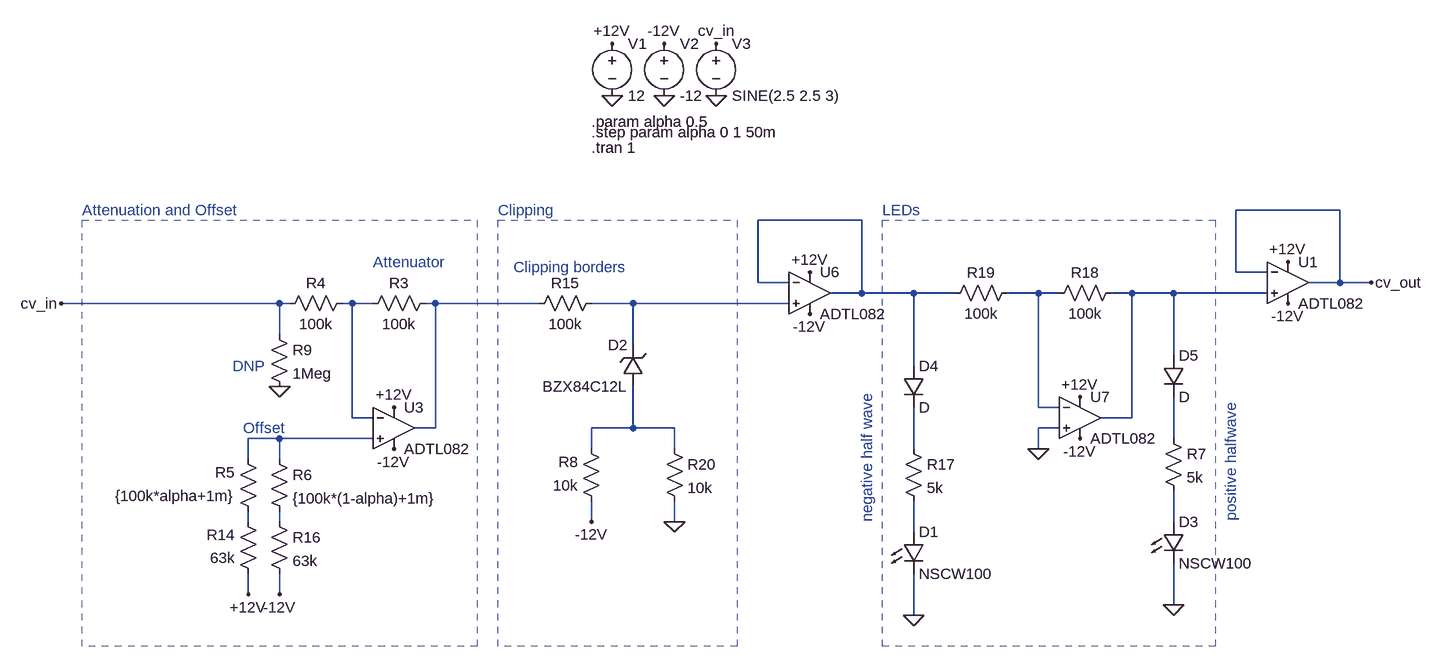
[diagram p0: schematic strg+m.asc]
strg+m.asc, the LTspice schematic file:
Version 4
SHEET 1 2040 1588
WIRE 1696 -16 1536 -16
WIRE 960 0 800 0
WIRE 1536 80 1536 -16
WIRE 1584 80 1536 80
WIRE 800 96 800 0
WIRE 848 96 800 96
WIRE 1696 96 1696 -16
WIRE 1696 96 1648 96
WIRE 1744 96 1696 96
WIRE 960 112 960 0
WIRE 960 112 912 112
WIRE 1040 112 960 112
WIRE 1104 112 1040 112
WIRE 1232 112 1184 112
WIRE 1264 112 1232 112
WIRE 1376 112 1344 112
WIRE 1440 112 1376 112
WIRE 1584 112 1440 112
WIRE 64 128 -272 128
WIRE 80 128 64 128
WIRE 176 128 160 128
WIRE 208 128 176 128
WIRE 304 128 288 128
WIRE 464 128 304 128
WIRE 608 128 544 128
WIRE 848 128 608 128
WIRE 64 176 64 128
WIRE 608 192 608 128
WIRE 1440 208 1440 112
WIRE 1040 224 1040 112
WIRE 1232 288 1232 112
WIRE 1264 288 1232 288
WIRE 176 304 176 128
WIRE 208 304 176 304
WIRE 1376 304 1376 112
WIRE 1376 304 1328 304
WIRE 304 320 304 128
WIRE 304 320 272 320
WIRE 608 320 608 256
WIRE 608 320 544 320
WIRE 672 320 608 320
WIRE 1264 320 1232 320
WIRE 64 336 16 336
WIRE 208 336 64 336
WIRE 1440 336 1440 272
WIRE 544 352 544 320
WIRE 672 352 672 320
WIRE 1040 352 1040 288
WIRE 1232 352 1232 320
WIRE 16 368 16 336
WIRE 64 368 64 336
WIRE 16 464 16 448
WIRE 64 464 64 448
WIRE 544 464 544 432
WIRE 672 464 672 432
WIRE 1440 464 1440 416
WIRE 1040 480 1040 432
WIRE 16 576 16 544
WIRE 64 576 64 544
WIRE 1440 592 1440 528
WIRE 1040 608 1040 544
FLAG 576 -192 0
FLAG 656 -192 0
FLAG 736 -192 0
FLAG 576 -272 +12V
FLAG 656 -272 -12V
FLAG 736 -272 cv_in
FLAG 240 288 +12V
FLAG 240 352 -12V
FLAG -272 128 cv_in
FLAG 16 576 +12V
FLAG 64 576 -12V
FLAG 64 256 0
FLAG 880 80 +12V
FLAG 880 144 -12V
FLAG 1744 96 cv_out
FLAG 1040 608 0
FLAG 1296 272 +12V
FLAG 1296 336 -12V
FLAG 1232 352 0
FLAG 1440 592 0
FLAG 672 464 0
FLAG 544 464 -12V
FLAG 1616 64 +12V
FLAG 1616 128 -12V
SYMBOL voltage 576 -288 R0
WINDOW 123 0 0 Left 0
WINDOW 39 0 0 Left 0
SYMATTR InstName V1
SYMATTR Value 12
SYMBOL voltage 656 -288 R0
WINDOW 123 0 0 Left 0
WINDOW 39 0 0 Left 0
SYMATTR InstName V2
SYMATTR Value -12
SYMBOL voltage 736 -288 R0
WINDOW 123 0 0 Left 0
WINDOW 39 0 0 Left 0
SYMATTR InstName V3
SYMATTR Value SINE(2.5 2.5 3)
SYMBOL OpAmps\\ADTL082 240 256 R0
SYMATTR InstName U3
SYMBOL res 304 112 R90
WINDOW 0 0 56 VBottom 2
WINDOW 3 32 56 VTop 2
SYMATTR InstName R3
SYMATTR Value 100k
SYMBOL res 32 464 R180
WINDOW 0 36 76 Left 2
WINDOW 3 36 40 Left 2
SYMATTR InstName R5
SYMATTR Value {100k*alpha+1m}
SYMBOL res 48 352 R0
SYMATTR InstName R6
SYMATTR Value {100k*(1-alpha)+1m}
SYMBOL res 176 112 R90
WINDOW 0 0 56 VBottom 2
WINDOW 3 32 56 VTop 2
SYMATTR InstName R4
SYMATTR Value 100k
SYMBOL res 48 160 R0
SYMATTR InstName R9
SYMATTR Value 1Meg
SYMBOL res 560 112 R90
WINDOW 0 0 56 VBottom 2
WINDOW 3 32 56 VTop 2
SYMATTR InstName R15
SYMATTR Value 100k
SYMBOL zener 624 256 R180
WINDOW 0 24 64 Left 2
WINDOW 3 24 0 Left 2
SYMATTR InstName D2
SYMATTR Value BZX84C12L
SYMBOL OpAmps\\ADTL082 880 48 R0
SYMATTR InstName U6
SYMBOL res 32 560 R180
WINDOW 0 36 76 Left 2
WINDOW 3 36 40 Left 2
SYMATTR InstName R14
SYMATTR Value 63k
SYMBOL res 48 448 R0
SYMATTR InstName R16
SYMATTR Value 63k
SYMBOL res 1024 336 R0
SYMATTR InstName R17
SYMATTR Value 5k
SYMBOL LED 1024 480 R0
SYMATTR InstName D1
SYMATTR Value NSCW100
SYMATTR Description Diode
SYMATTR Type diode
SYMBOL diode 1024 224 R0
SYMATTR InstName D4
SYMBOL OpAmps\\ADTL082 1296 240 R0
SYMATTR InstName U7
SYMBOL res 1360 96 R90
WINDOW 0 0 56 VBottom 2
WINDOW 3 32 56 VTop 2
SYMATTR InstName R18
SYMATTR Value 100k
SYMBOL res 1200 96 R90
WINDOW 0 0 56 VBottom 2
WINDOW 3 32 56 VTop 2
SYMATTR InstName R19
SYMATTR Value 100k
SYMBOL res 1424 320 R0
SYMATTR InstName R7
SYMATTR Value 5k
SYMBOL LED 1424 464 R0
SYMATTR InstName D3
SYMATTR Value NSCW100
SYMATTR Description Diode
SYMATTR Type diode
SYMBOL diode 1424 208 R0
SYMATTR InstName D5
SYMBOL res 560 448 R180
WINDOW 0 36 76 Left 2
WINDOW 3 36 40 Left 2
SYMATTR InstName R8
SYMATTR Value 10k
SYMBOL res 656 336 R0
SYMATTR InstName R20
SYMATTR Value 10k
SYMBOL OpAmps\\ADTL082 1616 32 R0
SYMATTR InstName U1
TEXT 544 -112 Left 2 !.tran 1
TEXT 544 -136 Left 2 !.step param alpha 0 1 50m
TEXT 544 -152 Left 2 !.param alpha 0.5
TEXT 320 64 Right 2 ;Attenuator
TEXT 8 320 Left 2 ;Offset
TEXT 424 72 Left 2 ;Clipping borders
TEXT -240 -16 Left 2 ;Attenuation and Offset
TEXT 400 -16 Left 2 ;Clipping
TEXT 968 264 VRight 2 ;negative half wave
TEXT 1528 280 VRight 2 ;positive halfwave
TEXT 992 -16 Left 2 ;LEDs
TEXT -8 224 Left 2 ;DNP
RECTANGLE Normal 368 656 -240 0 2
RECTANGLE Normal 768 656 400 0 2
RECTANGLE Normal 1504 656 992 0 2

The netlist it stands for:
* strg+m.asc
V1 +12V 0 12
V2 -12V 0 -12
V3 cv_in 0 SINE(2.5 2.5 3)
XU3 N008 N004 +12V -12V N005 ADTL082  ; pins In+ In- V+ V- OUT
R3 N005 N004 100k
R5 N011 N008 {100k*alpha+1m}
R6 N008 N012 {100k*(1-alpha)+1m}
R4 N004 cv_in 100k
R9 cv_in 0 1Meg
R15 N006 N005 100k
D2 N007 N006 BZX84C12L
XU6 N006 N001 +12V -12V N001 ADTL082  ; pins In+ In- V+ V- OUT
R14 +12V N011 63k
R16 N012 -12V 63k
R17 N010 N014 5k
D1 N014 0 NSCW100
D4 N001 N010 D
XU7 0 N002 +12V -12V N003 ADTL082  ; pins In+ In- V+ V- OUT
R18 N003 N002 100k
R19 N002 N001 100k
R7 N009 N013 5k
D3 N013 0 NSCW100
D5 N003 N009 D
R8 -12V N007 10k
R20 N007 0 10k
XU1 N003 cv_out +12V -12V cv_out ADTL082  ; pins In+ In- V+ V- OUT
.model D D
.lib standard.dio
.tran 1
.step param alpha 0 1 50m
.param alpha 0.5
* Attenuator
* Offset
* Clipping borders
* Attenuation and Offset
* Clipping
* negative half wave
* positive halfwave
* LEDs
* DNP
.lib ADI.lib
.backanno
.end